# EAGLE schematic project_mount_board (EAGLE 9.1.3)

## Sheet 1 of 2: Wifi
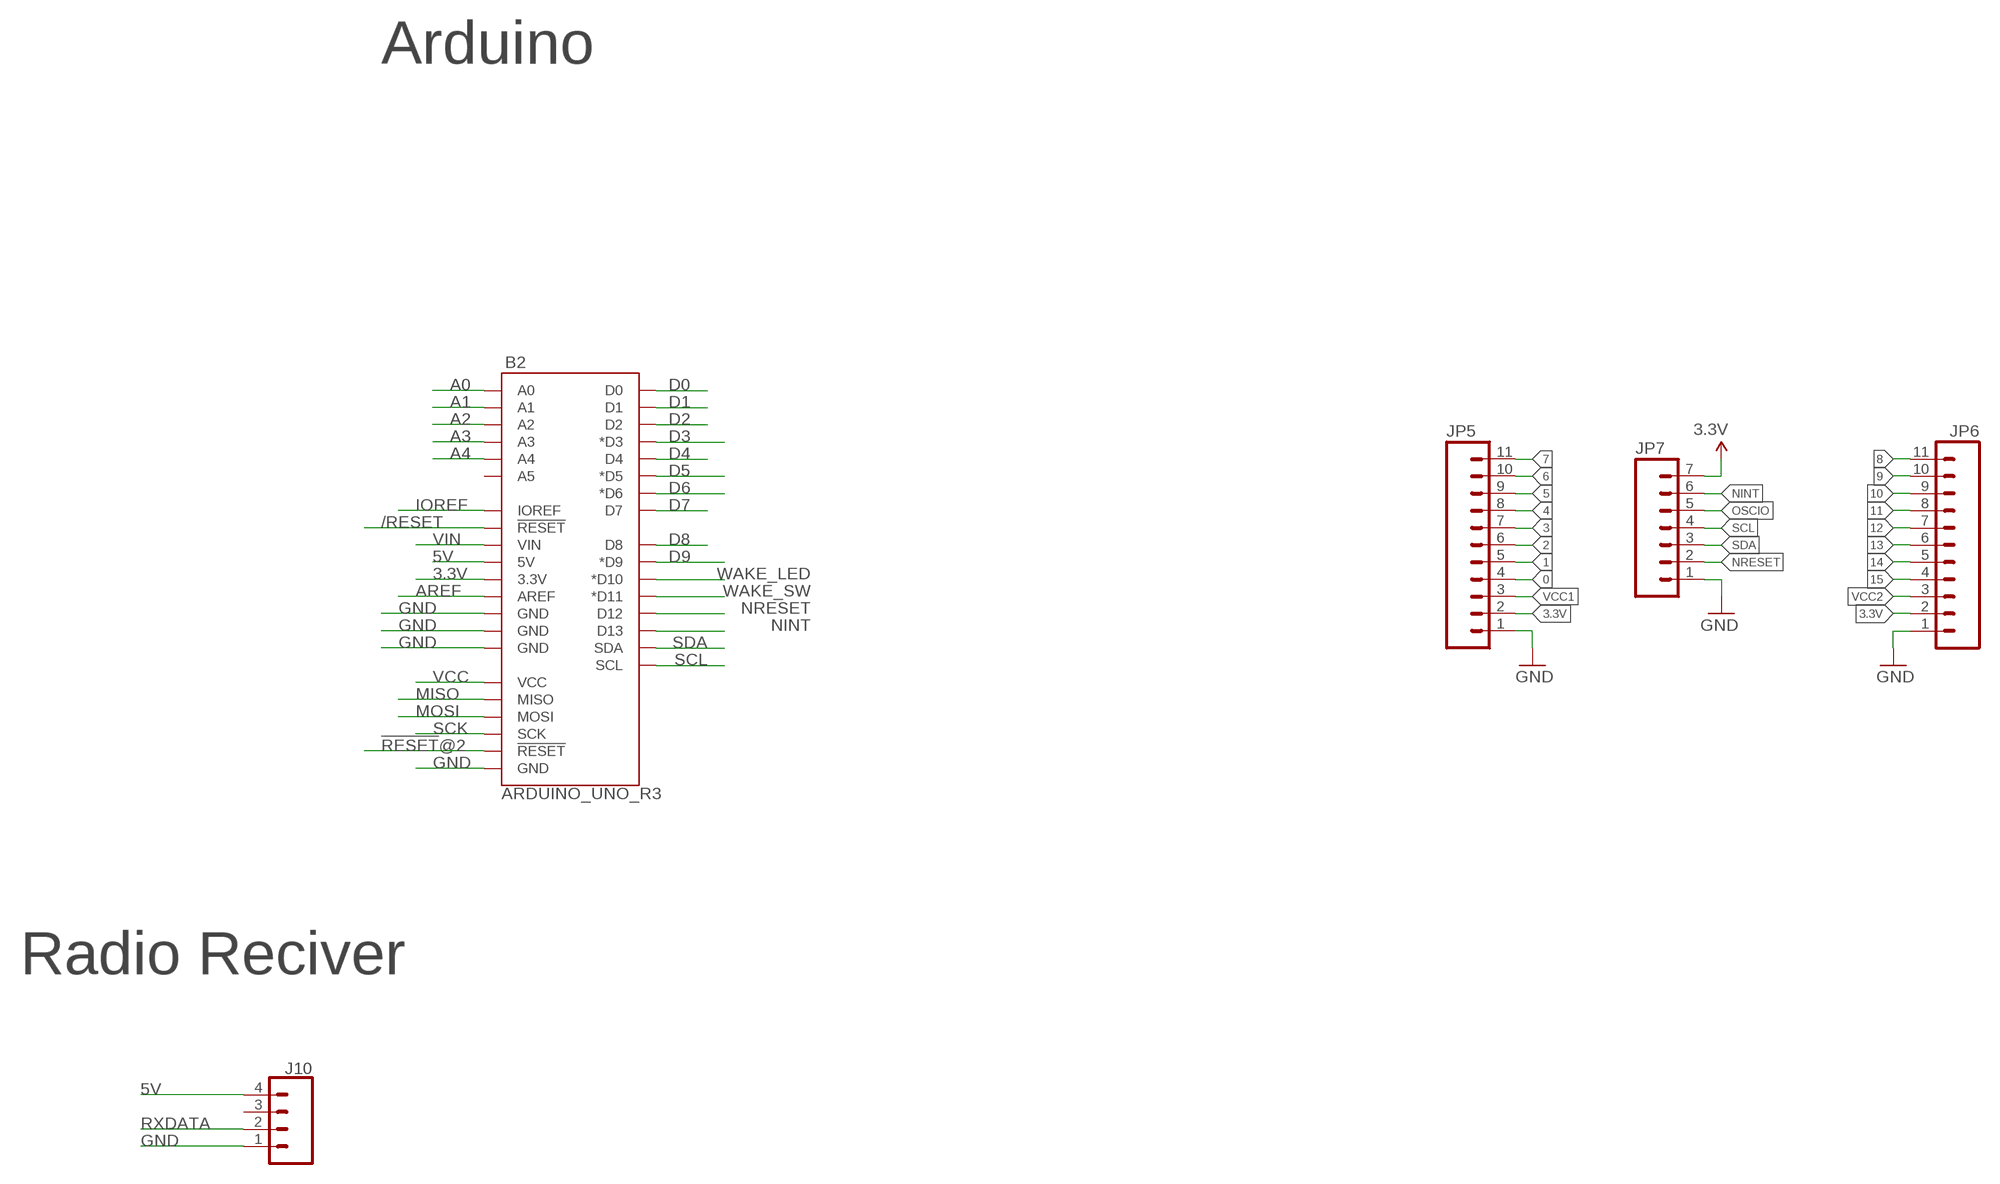
[diagram p0: schematic, sheet 1]

### Parts
B2  ARDUINO_UNO_R3  [ARDUINO_R3]
J10  CONN_04  [1X04]
JP5  M111X11_NO_SILK  [1X11_NO_SILK]
JP6  M111X11_NO_SILK  [1X11_NO_SILK]
JP7  M07  [1X07]

### Nets
0: JP5.4
1: JP5.5
2: JP5.6
3: JP5.7
3.3V: B2.3.3V JP5.2 JP6.2 JP7.7
4: JP5.8
5: JP5.9
5V: B2.5V J10.4
6: JP5.10
7: JP5.11
8: JP6.11
9: JP6.10
10: JP6.9
11: JP6.8
12: JP6.7
13: JP6.6
14: JP6.5
15: JP6.4
!RESET!@2: B2.RESET@2(!RESET!)
/RESET: B2.RESET@1(!RESET!)
A0: B2.A0
A1: B2.A1
A2: B2.A2
A3: B2.A3
A4: B2.A4
AREF: B2.AREF
D0: B2.D0
D1: B2.D1
D2: B2.D2
D3: B2.D3(*D3)
D4: B2.D4
D5: B2.D5(*D5)
D6: B2.D6(*D6)
D7: B2.D7
D8: B2.D8
D9: B2.D9(*D9)
GND: B2.GND@1(GND) B2.GND@2(GND) B2.GND@3(GND) B2.GND@4(GND) J10.1 JP5.1 JP6.1 JP7.1
IOREF: B2.IOREF
MISO: B2.MISO
MOSI: B2.MOSI
NINT: B2.D13 JP7.6
NRESET: B2.D12 JP7.2
OSCIO: JP7.5
RXDATA: J10.2
SCK: B2.SCK
SCL: B2.SCL JP7.4
SDA: B2.SDA JP7.3
VCC: B2.VCC
VCC1: JP5.3
VCC2: JP6.3
VIN: B2.VIN
WAKE_LED: B2.D10(*D10)
WAKE_SW: B2.D11(*D11)
Unconnected: B2.A5 J10.3

### Notes on the sheet
- Arduino
- Radio Reciver

## Sheet 2 of 2

## Library data of the parts
B2 = SparkFun-Boards:ARDUINO_UNO_R3: Arduino R3 Footprint with SPI header Arduino Uno R3 Compatible Footprint. Matches PCB size of the original board. SparkFun Products: SAMD21 Dev Breakout <https://www.sparkfun.com/products/13672> RedBoard <https://www.sparkfun.com/products/12757> R3 Stackable Headers <https://www.sparkfun.com/products/11417>
J10 = SparkFun-Connectors:CONN_04: Multi connection point. Often used as Generic Header-pin footprint for 0.1 inch spaced/style header connections On any of the 0.1 inch spaced packages, you can populate with these: Break Away Headers - Straight <https://www.sparkfun.com/products/116> (PRT-00116) Break Away Male Headers - Right Angle <https://www.sparkfun.com/products/553> (PRT-00553) Female Headers <https://www.sparkfun.com/products/115> (PRT-00115) Break Away Headers - Machine Pin <https://www.sparkfun.com/products/117> (PRT-00117) Break Away Female Headers - Swiss Machine Pin <https://www.sparkfun.com/products/743> (PRT-00743) For SCREWTERMINALS and SPRING TERMINALS visit here: Screw Terimnals on SparkFun.com <https://www.sparkfun.com/search/results?term=Screw+Terminals> (5mm/3.5mm/2.54mm spacing) This device is also useful as a general connection point to wire up your design to another part of your project. Our various solder wires solder well into these plated through hole pads. Hook-Up Wire - Assortment (Stranded, 22 AWG) <https://www.sparkfun.com/products/11375> (PRT-11375) Hook-Up Wire - Assortment (Solid Core, 22 AWG) <https://www.sparkfun.com/products/11367> (PRT-11367) View the entire wire category on our website here <https://www.sparkfun.com/categories/141> Special notes: Molex polarized connector foot print use with SKU : PRT-08231 with associated crimp pins and housings. 1MM SMD Version SKU: PRT-10208; PROD_ID: CONN-09696
JP5 JP6 = SparkFun-Connectors:M11: Header 11 Standard 11-pin 0.1" header. Use with straight break away headers (SKU : PRT-00116), right angle break away headers (PRT-00553), swiss pins (PRT-00743), machine pins (PRT-00117), and female headers (PRT-00115).
JP7 = SparkFun-Connectors:M07: Header 7 Standard 7-pin 0.1" header. Use with straight break away headers (SKU : PRT-00116), right angle break away headers (PRT-00553), swiss pins (PRT-00743), machine pins (PRT-00117), and female headers (PRT-00115). NOTES ON THE VARIANTS LOCK and LOCK_LONGPADS... This footprint was designed to help hold the alignment of a through-hole component (i.e. 7-pin header) while soldering it into place. You may notice that each hole has been shifted either up or down by 0.005 of an inch from it's more standard position (which is usually a perfectly straight line). This slight alteration caused the pins (the squares in the middle) to touch the edges of the holes. Because they are alternating, it causes a "brace" to hold the header in place. 0.005 has proven to be the perfect amount of "off-center" position when using our standard breakaway headers. Although looks a little odd when you look at the bare footprint, once you have a header in there, the alteration is very hard to notice. Also, if you push a header all the way into place, it is covered up entirely on the bottom side. This idea of altering the position of holes to aid alignment will be further integrated into the Sparkfun Library for other footprints. It can help hold any component with 3 or more connection pins.